# EAGLE design TT7D v1.0 (EAGLE 7.7.0)
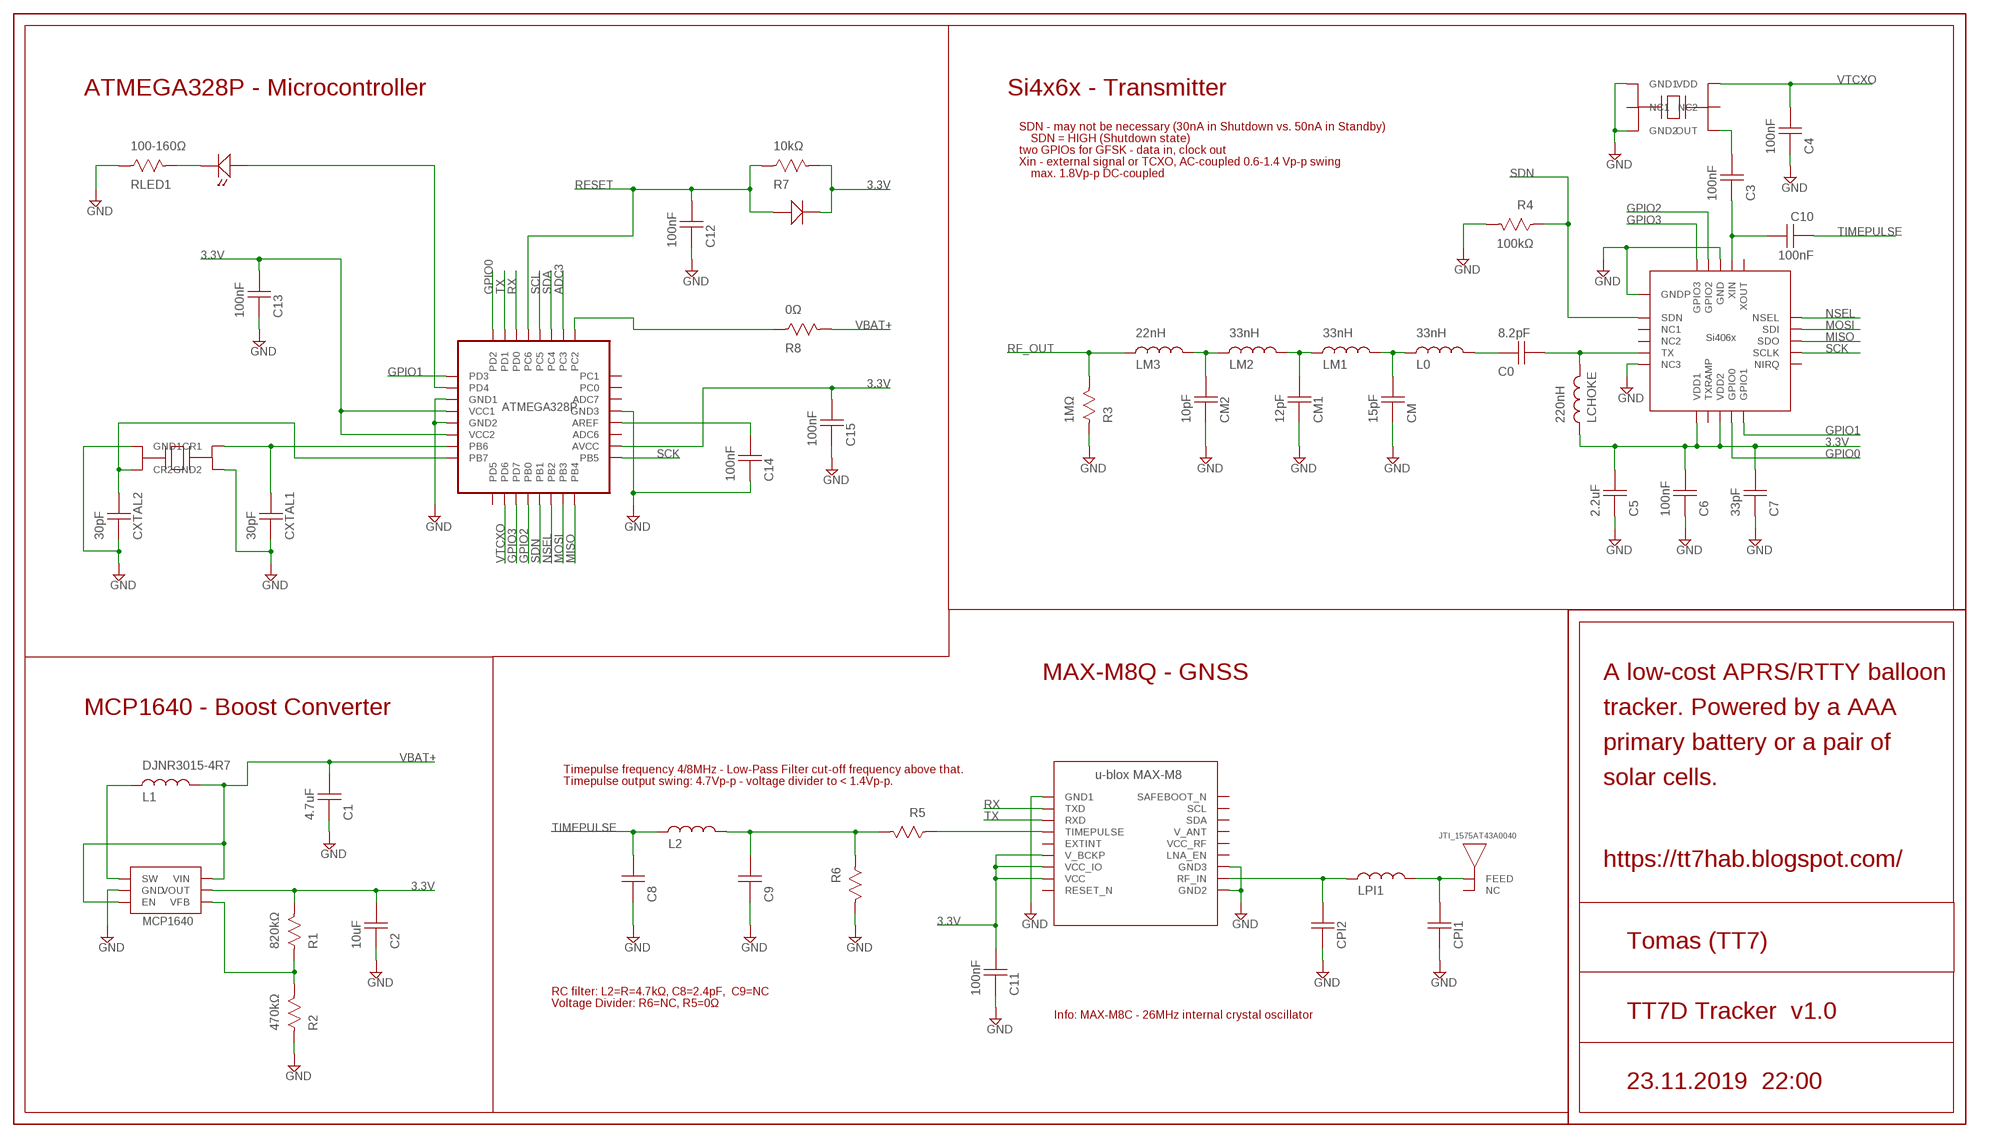
[diagram p0: schematic, sheet 1]

## Parts
ANT1  JTI_1575AT43A0040  [JTI_1575AT43A0040]
C0  8.2pF  CAP0402  [CAP0402]
C1  4.7uF  CAP0402  [CAP0402]
C2  10uF  CAP0402  [CAP0402]
C3  100nF  CAP0402  [CAP0402]
C4  100nF  CAP0402  [CAP0402]
C5  2.2uF  CAP0402  [CAP0402]
C6  100nF  CAP0402  [CAP0402]
C7  33pF  CAP0402  [CAP0402]
C8  CAP0402  [CAP0402]
C9  CAP0402  [CAP0402]
C10  100nF  CAP0402  [CAP0402]
C11  100nF  CAP0402  [CAP0402]
C12  100nF  CAP0402  [CAP0402]
C13  100nF  CAP0402  [CAP0402]
C14  100nF  CAP0402  [CAP0402]
C15  100nF  CAP0402  [CAP0402]
CM  15pF  CAP0402  [CAP0402]
CM1  12pF  CAP0402  [CAP0402]
CM2  10pF  CAP0402  [CAP0402]
CPI1  CAP0402  [CAP0402]
CPI2  CAP0402  [CAP0402]
CXTAL1  30pF  CAP0402  [CAP0402]
CXTAL2  30pF  CAP0402  [CAP0402]
D1  DIODE0402  [DIODE0402]
L0  33nH  IND0402  [IND0402]
L1  DJNR3015-4R7  DJNR3015  [DJNR3015]
L2  IND0402  [IND0402]
LCHOKE  220nH  IND0402  [IND0402]
LED1  LED0603  [LED0603]
LM1  33nH  IND0402  [IND0402]
LM2  33nH  IND0402  [IND0402]
LM3  22nH  IND0402  [IND0402]
LPI1  IND0402  [IND0402]
R1  820kΩ  RES0402  [RES0402]
R2  470kΩ  RES0402  [RES0402]
R3  1MΩ  RES0402  [RES0402]
R4  100kΩ  RES0402  [RES0402]
R5  RES0402  [RES0402]
R6  RES0402  [RES0402]
R7  10kΩ  RES0402  [RES0402]
R8  0Ω  RES0402  [RES0402]
RLED1  100-160Ω  RES0402  [RES0402]
U1  ATMEGA328P-AU  [ATMEGA328P-AU]
U2  UBLOX_MAX-7C  [UBLOX_MAX-7C]
U3  SI406X  [SI406X]
U4  IT3205CE_TCXO_6P  [IT3205CE_TCXO_6P]
U5  MCP1640  [MCP1640]
XTAL1  LFXTAL055663  [LFXTAL055663]

## Nets
3.3V: C2.P$2 C5.P$2 C6.P$2 C7.P$2 C11.P$2 C13.P$2 C15.P$2 D1.CATHODE LCHOKE.P$1 R1.P$2 R7.P$2 U1.AVCC U1.VCC1 U1.VCC2 U2.V_BCKP U2.VCC U2.VCC_IO U3.VDD1 U3.VDD2 U5.VOUT
ADC3: U1.PC3
GND: C1.P$1 C2.P$1 C4.P$1 C5.P$1 C6.P$1 C7.P$1 C8.P$1 C9.P$1 C11.P$1 C12.P$1 C13.P$1 C14.P$1 C15.P$1 CM1.P$1 CM2.P$1 CM.P$1 CPI1.P$1 CPI2.P$1 CXTAL1.P$1 CXTAL2.P$1 R2.P$1 R3.P$1 R4.P$2 R6.P$2 RLED1.P$1 U1.GND1 U1.GND2 U1.GND3 U2.GND1 U2.GND2 U2.GND3 U3.GND U3.GNDP U3.NC3 U4.GND1 U4.GND2 U5.GND XTAL1.GND1 XTAL1.GND2
GPIO0: U1.PD2 U3.GPIO0
GPIO1: U1.PD3 U3.GPIO1
GPIO2: U1.PB0 U3.GPIO2
GPIO3: U1.PD7 U3.GPIO3
MISO: U1.PB4 U3.SDO
MOSI: U1.PB3 U3.SDI
N$1: CXTAL2.P$2 U1.PB7 XTAL1.CRYSTAL2(CR2)
N$3: CXTAL1.P$2 U1.PB6 XTAL1.CRYSTAL1(CR1)
N$4: LED1.CATHODE RLED1.P$2
N$6: CPI2.P$2 LPI1.P$1 U2.RF_IN
N$9: L1.P1 U5.SW
N$10: CM.P$2 L0.P$1 LM1.P$2
N$11: CM1.P$2 LM1.P$1 LM2.P$2
N$12: R1.P$1 R2.P$2 U5.VFB
N$13: CM2.P$2 LM2.P$1 LM3.P$2
N$14: C0.P$1 L0.P$2
N$15: C0.P$2 LCHOKE.P$2 U3.TX
N$16: C14.P$2 U1.AREF
N$17: C3.P$1 C10.P$2 U3.XIN
N$18: C3.P$2 U4.OUT
N$20: LED1.ANODE U1.PD4
N$21: R5.P$1 U2.TIMEPULSE
N$22: C9.P$2 L2.P$2 R5.P$2 R6.P$1
N$23: R8.P$1 U1.PC2
NSEL: U1.PB2 U3.NSEL
RESET: C12.P$2 D1.ANODE R7.P$1 U1.PC6
RF_IN: ANT1.FEED CPI1.P$2 LPI1.P$2
RF_OUT: LM3.P$1 R3.P$2
RX: U1.PD0 U2.TXD
SCK: U1.PB5 U3.SCLK
SCL: U1.PC5
SDA: U1.PC4
SDN: R4.P$1 U1.PB1 U3.SDN
TIMEPULSE: C8.P$2 C10.P$1 L2.P$1
TX: U1.PD1 U2.RXD
VBAT+: C1.P$2 L1.P2 R8.P$2 U5.EN U5.VIN
VTCXO: C4.P$2 U1.PD6 U4.VDD
Unconnected: ANT1.NC U1.ADC6 U1.ADC7 U1.PC0 U1.PC1 U1.PD5 U2.EXTINT U2.LNA_EN U2.RESET_N U2.SAFEBOOT_N U2.SCL U2.SDA U2.V_ANT U2.VCC_RF U3.NC1 U3.NC2 U3.NIRQ U3.TXRAMP U3.XOUT U4.NC1 U4.NC2

## Notes on the sheet
- ATMEGA328P - Microcontroller | Si4x6x - Transmitter
- SDN - may not be necessary (30nA in Shutdown vs. 50nA in Standby)
- SDN = HIGH (Shutdown state)
- two GPIOs for GFSK - data in, clock out
- Xin - external signal or TCXO, AC-coupled 0.6-1.4 Vp-p swing
- max. 1.8Vp-p DC-coupled
- MAX-M8Q - GNSS | A low-cost APRS/RTTY balloon
- MCP1640 - Boost Converter | tracker. Powered by a AAA
- primary battery or a pair of
- Timepulse frequency 4/8MHz - Low-Pass Filter cut-off frequency above that.
- Timepulse output swing: 4.7Vp-p - voltage divider to < 1.4Vp-p. | solar cells.
- https://tt7hab.blogspot.com/
- Tomas (TT7)
- RC filter: L2=R=4.7kΩ, C8=2.4pF,  C9=NC
- Voltage Divider: R6=NC, R5=0Ω
- Info: MAX-M8C - 26MHz internal crystal oscillator | TT7D Tracker  v1.0
- 23.11.2019  22:00

## Library data of the parts
ANT1 = TT7:JTI_1575AT43A0040: JTI_1575AT43A0040 GNSS antenna footprint.
C0 C1-C15 CM CM1 CM2 CPI1 CPI2 CXTAL1 CXTAL2 = TT7:CAP0402: CAPACITOR 0402 - 1 x 0.5 x 0.35mm
D1 = TT7:DIODE0402: DIODE 0402 - 1x0.5x0.35mm. Pad size 0.5x0.6mm. Solder Mask: 0.051mm around pads. Stencil: 66% pad coverage.
L0 L2 LCHOKE LM1-LM3 LPI1 = TT7:IND0402: INDUCTOR 0402 - 1 x 0.5 x 0.35mm
L1 = TT7:DJNR3015: DJNR3015 inductor footprint.
LED1 = TT7:LED0603: LED 0603
R1-R8 RLED1 = TT7:RES0402: RESISTOR 0402 - 1 x 0.5 x 0.35mm
U1 = TT7:ATMEGA328P-AU: ATMEGA328P in a TQFP32 package.; DESCRIPTION: 8-bit Microcontroller with In-System Programmable Flash; MPN: ATMEGA328P-AU; OC_FARNELL: 1715486; OC_NEWARK: 14R4631; PACKAGE: TQFP-32; SUPPLIER: Atmel
U2 = TT7:UBLOX_MAX-7C: U-Blox MAX-M8.
U3 = TT7:SI406X: SI406x transmitter footprint.
U4 = TT7:IT3205CE_TCXO_6P: IT3205CE 16.369MHz TCXO with 6 pads.
U5 = TT7:MCP1640: MCP1640 in SOT23 package.
XTAL1 = TT7:LFXTAL055663: LFXTAL055663 XTAL footprint in a 5.0x3.2mm package.

## Board
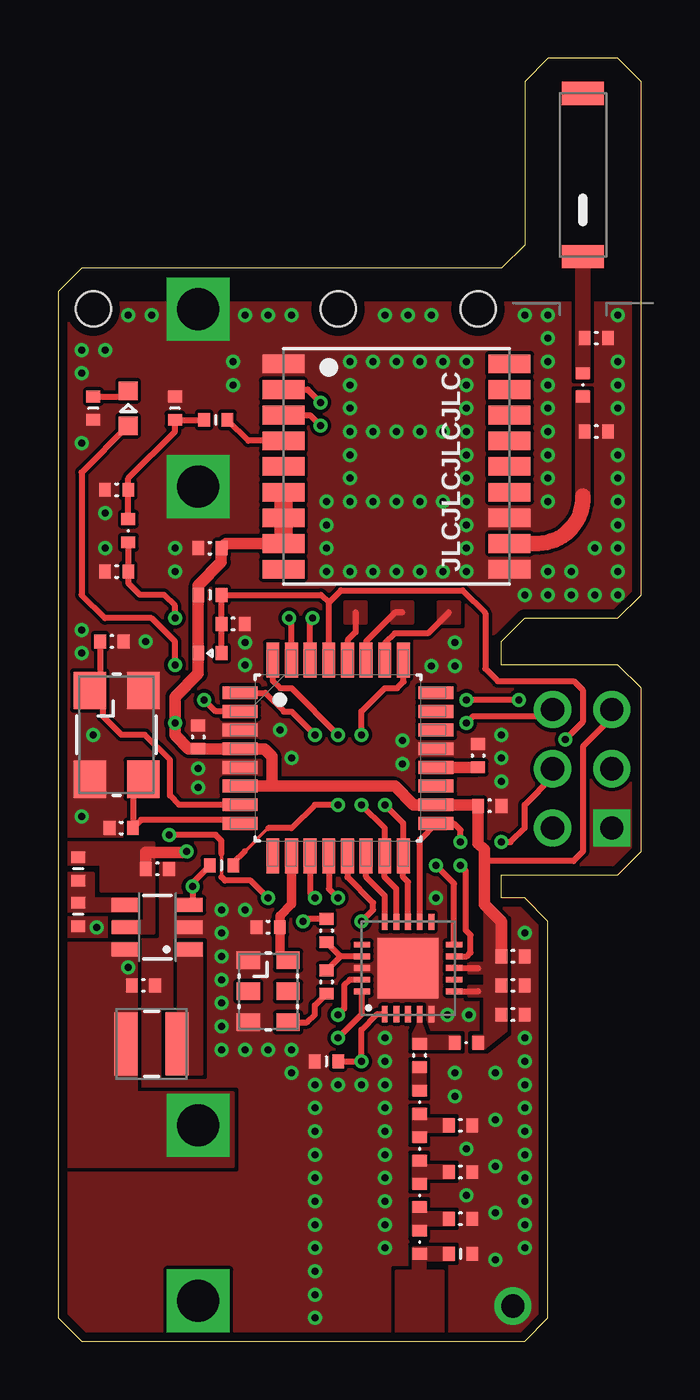
[diagram p1: board, top side]
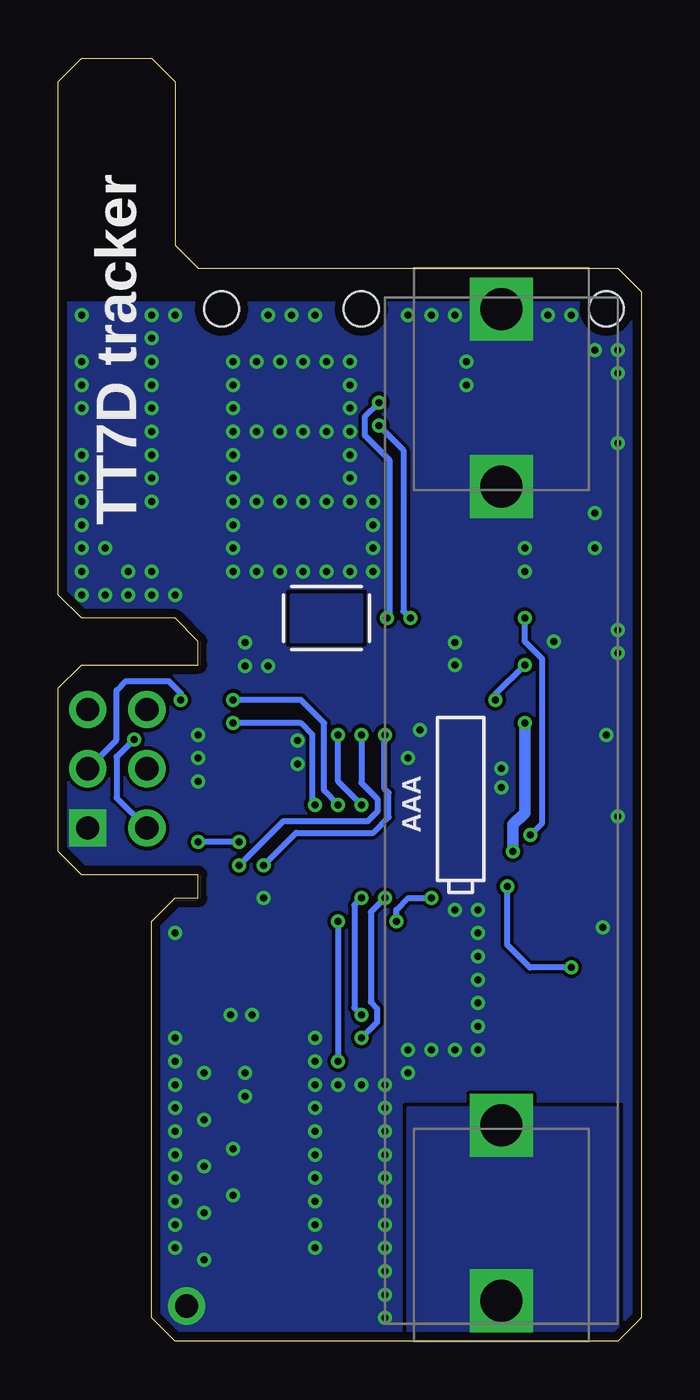
[diagram p2: board, bottom side, seen from below]

Size 25 x 55 mm. Coordinates in mm from the lower left corner, seen from the top.
Outline: 0,1 1,0 20,0 21,1 21,18 20,19 19,19 19,20 24,20 25,21 25,28 24,29 19,29 19,30 20,31 24,31 25,32 25,54 24,55 21,55 20,54 20,47 19,46 1,46 0,45 0,1
Copper layers (1*16): Top 0.035559375mm / dielectric 1.6mm / Bottom 0.035559375mm
Design rules "oshpark-2layer *": minimum track width 6mil, minimum drill 10mil, track to track 6mil, track to pad 6mil, pad to pad 6mil, via to via 6mil, smd to smd 6mil, copper to edge 15mil, drill to drill 6mil, minimum pad ring 5mil, minimum via ring 5mil, stop-mask expansion 2.5mil, vias tented up to drill 20mil, thermal gap 10mil
Holes 1.5 mm at 1.5,44.25 12,44.25 18,44.25

### Footprints (pad centres in the part's own frame; a part is rotated, then mirrored left to right if it is on the bottom)
JTI_1575AT43A0040 = smd 1 x 1.8: FEED -3.5,0; NC 3.5,0
CAP0402 = smd 0.5 x 0.6: P$1 -0.5,0; P$2 0.5,0
DIODE0402 = smd 0.5 x 0.6: ANODE -0.5,0; CATHODE 0.5,0
IND0402 = smd 0.5 x 0.6: P$1 -0.5,0; P$2 0.5,0
DJNR3015 = smd 1 x 2.7: P1 -1.1,0; P2 1.1,0
LED0603 = smd 0.8 x 0.8: ANODE -0.75,0; CATHODE 0.75,0
RES0402 = smd 0.5 x 0.6: P$1 -0.5,0; P$2 0.5,0
ATMEGA328P-AU = smd 1.5 x 0.55: ADC6 4.2,-1.2; ADC7 4.2,1.2; AREF 4.2,-0.4; AVCC 4.2,-2; GND1 -4.2,1.2; GND2 -4.2,-0.4; GND3 4.2,0.4; PB5 4.2,-2.8; PB6 -4.2,-2; PB7 -4.2,-2.8; PC0 4.2,2; PC1 4.2,2.8; PD3 -4.2,2.8; PD4 -4.2,2; VCC1 -4.2,0.4; VCC2 -4.2,-1.2 | smd 0.55 x 1.5: PB0 -0.4,-4.2; PB1 0.4,-4.2; PB2 1.2,-4.2; PB3 2,-4.2; PB4 2.8,-4.2; PC2 2.8,4.2; PC3 2,4.2; PC4 1.2,4.2; PC5 0.4,4.2; PC6 -0.4,4.2; PD0 -1.2,4.2; PD1 -2,4.2; PD2 -2.8,4.2; PD5 -2.8,-4.2; PD6 -2,-4.2; PD7 -1.2,-4.2
UBLOX_MAX-7C = smd 1.8 x 0.8: EXTINT -4.85,0; GND1 -4.85,4.4; GND2 4.85,-4.4; GND3 4.85,-2.2; LNA_EN 4.85,-1.1; RESET_N -4.85,-4.4; RF_IN 4.85,-3.3; RXD -4.85,2.2; SAFEBOOT_N 4.85,4.4; SCL 4.85,3.3; SDA 4.85,2.2; TIMEPULSE -4.85,1.1; TXD -4.85,3.3; V_ANT 4.85,1.1; V_BCKP -4.85,-1.1; VCC -4.85,-3.3; VCC_IO -4.85,-2.2; VCC_RF 4.85,0
SI406X = smd 0.25 x 0.7: GND 0,1.975; GPIO0 0.5,-1.975; GPIO1 1,-1.975; GPIO2 -0.5,1.975; GPIO3 -1,1.975; TXRAMP -0.5,-1.975; VDD1 -1,-1.975; VDD2 0,-1.975; XIN 0.5,1.975; XOUT 1,1.975 | smd 2.6 x 2.6: GNDP 0,0 | smd 0.7 x 0.25: NC1 -1.975,0.5; NC2 -1.975,0; NC3 -1.975,-1; NIRQ 1.975,-1; NSEL 1.975,1; SCLK 1.975,-0.5; SDI 1.975,0.5; SDN -1.975,1; SDO 1.975,0; TX -1.975,-0.5
IT3205CE_TCXO_6P = smd 0.75 x 1: GND1 -1.325,-0.85; GND2 1.325,-0.85; NC1 0,-0.85; NC2 0,0.85; OUT 1.325,0.85; VDD -1.325,0.85
MCP1640 = smd 0.6 x 1.1: EN 0.95,-1.4; GND 0,-1.4; SW -0.95,-1.4; VFB 0.95,1.4; VIN -0.95,1.4; VOUT 0,1.4
LFXTAL055663 = smd 1.6 x 1.4: CRYSTAL1 -1.9,-1.15; CRYSTAL2 1.9,1.15; GND1 1.9,-1.15; GND2 -1.9,1.15

### Placement (x,y rotation side)
ANT1  22.5,50 90 top
C0  15.5,12.25 90 top
C1  3.65,15.25 180 top
C2  4.25,20.25 180 top
C3  11.5,15.4 270 top
C4  9,17.75 0 top
C5  19.5,16.5 180 top
C6  19.5,15.25 180 top
C7  19.5,14 180 top
C8  2.5,33 0 top
C9  2.5,36.5 0 top
C10  11.5,17.6 270 top
C11  6.5,34 0 top
C12  7.5,30.75 180 top
C13  6,25.9 270 top
C14  18,25.1 270 top
C15  18.5,22.95 180 top
CM  17.25,9.25 180 top
CM1  17.25,7.25 180 top
CM2  17.25,5.25 180 top
CPI1  23.07,43 180 top
CPI2  23.07,39 180 top
CXTAL1  2.3,30 180 top
CXTAL2  2.7,22 0 top
D1  6.5,29.5 180 top
L0  15.5,10.25 90 top
L1  4,12.75 180 top
L2  3,34.75 90 top
LCHOKE  17.5,12.8 180 top
LED1  3,40 90 top
LM1  15.5,8.25 90 top
LM2  15.5,6.25 90 top
LM3  15.5,4.25 90 top
LPI1  22.5,41 90 top
R1  0.85,20.25 90 top
R2  0.85,18.3 90 top
R3  17.25,3.75 180 top
R4  11.5,12 180 top
R5  6.75,39.5 180 top
R6  5,40 90 top
R7  6.5,32 180 top
R8  7,20.4 180 top
RLED1  1.5,40 90 top
U1  12,25 0 top
U2  14.5,37.5 0 top
U3  15,16 90 top
U4  9,15 270 top
U5  4.25,17.75 90 top
XTAL1  2.5,26 270 top

### Tracks (layer width: path | path; a pad name or v marks a point on that pad's centre or on a via)
3.3V  (via drill 0.3 pad 0.6, 1 pad 1.6)
  Top 0.25: U3.VDD1 18,15 | U3.VDD2 18,16 | v23.74,27.08 23.74,26.74 22.5,25.5 22.5,21 22.09,20.59 18.37,20.59 18.27,20.69
  Top 0.4: 17.95,23 C15.P$2
  Top 0.5: C5.P$2 19,17.99 18.27,18.72 18.27,20.69 18.27,21.08 18,21.35 C15.P$2 | 9.16,23.8 14.43,23.8 15.23,23 U1.AVCC 17.95,23 | 9.16,23.8 U1.VCC2 | 9.16,23.8 9.16,25.07 8.84,25.4 U1.VCC1 C13.P$2 5.6,25.4 5,26 v5,26.5 5,27.62 6,28.62 D1.CATHODE R7.P$2 6,32.4 6.99,33.39 C11.P$2 7.2,34.2 U2.VCC | v5.5,21 5.46,20.96 3.74,20.96 3.75,20.96 C2.P$2
  Top 0.8: U2.VCC U2.VCC_IO U2.V_BCKP
  Bottom 0.5: v5.5,21 5.5,22.15 5,22.65 v5,26.5
  pour Top (no thermals): 18.3,13.06 18.3,18 19.2,18 19.2,13.3 18.25,12.55 17.8,12.55 17.8,13.06
  pour Top (no thermals): 18.5,14.8 18.5,15.2 17.6,15.2 17.6,14.8
  pour Top (no thermals): 17.6,16.2 18.4,16.2 18.4,15.8 17.6,15.8
  pour Top (no thermals): 18.3,15.5 18.3,18.5 18.7,18.5 18.7,17.3 19,17 19,15.5
  pour Top (no thermals): 0,21.35 4.1,21.35 4.1,17.5 2.35,17.5 2.35,18 3.7,18 3.7,19.3 1.85,19.3 1.85,20.45 0,20.45
ADC3
  Top 0.25: 16.75,31.25 15.85,30.35 14.42,30.35 14.01,29.94 14.01,29.21 U1.PC3
  pour Top: 16.3,30.8 16.3,31.7 17.2,31.7 17.2,30.8
GND  (via drill 0.3 pad 0.6, 1 pad 1.6, 1.8)
  other vias: 23.74,22 19.5,1.5 21,37 21,38 17.5,42 7.5,42 24,38 24,37 24,36 24,35 24,34 20,11 14,11 14,10 14,9 14,8 14,7 14,6 14,5 14,4 20,4 20,5 20,6 20,7 20,8 20,9 20,10 8,29.95 20,12 20,13 10,12.5 9,12.5 8,12.5 7,12.5 7,13.5 7,14.5 7,15.5 10,11.5 11,11 12,11 13,11 11,4 11,5 11,6 11,7 11,8 11,9 11,10 11,3 11,2 11,1 17,10.5 17,11.5 17.5,8.25 17.5,6.25 20,17.5 16.7,14 17.6,14 18.75,5.5 18.75,7.5 18.75,9.5 18.75,3.5 21,39 21,40 21,41 21,42 21,43 21,44 24,44 24,42 24,41 24,40 21,36 24,33 23,32 24,32 22,32 21,32 20,32 22,33 23,34 21,33 6,36.65 6,44.25 7,16.5 7,17.5 7,18.5 14,12 14,13 8,18.5 18.75,11.5 1.65,17.75 6,24.55 6,23.75 19,24 1,38.5 1,41.5 1,22.5 2,35.5 2,34 20,44 16,44 15,44 14,44 10,44 9,44 8,44 4,44 3,44 1,42.5 3.75,30 1.5,26 9.5,26.2 19,25 8,29 12.5,42 13.5,42 14.5,42 15.5,42 16.5,42 17.5,33 16.5,33 15.5,33 13.5,33 14.5,33 12.5,33 11.5,33 17.5,34 17.5,35 17.5,36 17.5,37 17.5,38 17.5,39 17.5,40 17.5,41 16.5,36 15.5,36 14.5,36 13.5,36 12.5,36 11.5,36 16.5,39 15.5,39 14.5,39 13.5,39 12.5,39 11.5,35 11.5,34 12.5,40 12.5,41 12.5,37 12.5,38 7.5,41 2,42.5 5,34 5,33 1,29.5 1,30.5 14.75,24.75 16.2,19 10,25 14.75,25.75 17,29.95 17,28.95 16,28.95 19,26
  pour Top (rank 2, no thermals): 0,0 0,44.5 25,44.5 25,32 24,31 20,31 20,29 24,29 25,28 25,21 24,20 19,20 19,19 20,19 21,18 21,0
  pour Bottom (rank 2, no thermals): 0,0 0,44.5 25,44.5 25,32 24,31 20,31 20,29 24,29 25,28 25,21 24,20 19,20 19,19 20,19 21,18 21,0
GPIO0  (via drill 0.3 pad 0.6)
  Top 0.25: U3.GPIO0 17.52,16.5 17.69,16.67 17.69,17.41 17.48,17.62 17.48,20.18 v17.25,20.4 | U1.PD2 9.2,28.31 9.52,28 10.01,28 v12,26
  Bottom 0.25: v17.25,20.4 15.35,22.3 11.72,22.3 11.31,22.71 11.31,23.26 12,23.94 v12,26
GPIO1  (via drill 0.3 pad 0.6)
  Top 0.25: U3.GPIO1 16.98,19.62 v16.2,20.4 | U1.PD3 8.87,27.8 9.68,26.99 10.01,26.99 v11,26
  Bottom 0.25: v16.2,20.4 14.8,21.8 11.5,21.8 10.84,22.46 10.84,23.51 11.01,23.68 v11.01,25.99 v11,26
GPIO2  (via drill 0.3 pad 0.6)
  Top 0.25: U3.GPIO2 12.5,15.5 12.26,15.27 12.26,14.26 v12,14 | U1.PB0 11.6,19.4 v12,19
  Bottom 0.25: v12,19 12.3,18.7 12.3,14.3 v12,14
GPIO3  (via drill 0.3 pad 0.6)
  Top 0.25: v12,13 13.03,14.03 U3.GPIO3 | U1.PD7 10.8,19.2 v11,19
  Bottom 0.25: v11,19 11.6,18.4 11.6,14.54 11.31,14.25 11.31,13.69 v12,13
MISO  (via drill 0.3 pad 0.6, 1 pad 1.6)
  Top 0.25: U3.SDO 15,19.68 14.79,19.9 14.79,20.79 U1.PB4 14.8,22.2 v14,23 | v17.5,26.5 17.8,26.8 20.92,26.8 v21.2,27.08
  Bottom 0.25: v14,23 14.1,23.1 14.1,26 14.6,26.5 v17.5,26.5
MOSI  (via drill 0.3 pad 0.6, 1 pad 1.6)
  Top 0.25: U3.SDI 14.5,19.4 14,19.9 U1.PB3 14,22 v13,23 | v19.75,27.5 v17.5,27.5
  Bottom 0.25: v23.74,24.54 22.5,25.78 22.5,27.9 22.1,28.3 20.26,28.3 19.75,27.79 v19.75,27.5 | v13,23 13.6,23.6 13.6,26.5 14.6,27.5 v17.5,27.5
N$1
  Top 0.25: 3.4,22.2 CXTAL2.P$2 | XTAL1.CRYSTAL2 3.2,23.65 CXTAL2.P$2 | U1.PB7 7.65,22.35 3.55,22.35 CXTAL2.P$2
N$2
  pour Bottom: 12,32 15,32 15,30 12,30
N$3
  Top 0.25: CXTAL1.P$2 1.8,27.9 XTAL1.CRYSTAL1 1.92,27.33 1.92,26.79 2.71,26 3.72,26 4.79,24.93 4.79,23.39 5.18,23 U1.PB6
N$4
  Top 0.25: RLED1.P$2 2.75,40.5 LED1.CATHODE
N$6
  Top 0.66: 22.5,36.23 arc-90 20.59,34.2 U2.RF_IN
  pour Top (no thermals): 22.25,40.7 22.75,40.7 22.75,36 22.25,36
  pour Top (no thermals): 20.5,33.95 18.6,33.95 18.6,34.46 20.5,34.46
N$9
  pour Top (no thermals): 5.15,17.05 6.15,17.05 6.15,11.45 4.65,11.45 4.65,14.05 5.15,14.05
N$10
  pour Top (no thermals): 15.22,9.95 15.74,9.95 15.74,8.55 15.22,8.55
  pour Top (no thermals): 15.74,9.51 16.95,9.51 16.95,9 15.74,9
N$11
  pour Top (no thermals): 15.22,7.95 15.74,7.95 15.74,6.55 15.22,6.55
  pour Top (no thermals): 15.74,7 15.74,7.51 16.95,7.51 16.95,7
N$12
  pour Top (no thermals): 3.35,18.45 3.35,18.95 1.5,18.95 1.5,20.05 0,20.05 0,18.45
N$13
  pour Top (no thermals): 15.22,5.95 15.74,5.95 15.74,4.55 15.22,4.55
  pour Top (no thermals): 15.74,5.51 16.95,5.51 16.95,5 15.74,5
N$14
  pour Top (no thermals): 15.22,11.95 15.74,11.95 15.74,10.55 15.22,10.55
N$15
  pour Top (no thermals): 15.22,12.55 15.74,12.55 15.74,13.15 15.56,13.6 15.44,13.6 15.22,13.15
  pour Top (no thermals): 15.44,14.3 15.56,14.3 15.56,13.6 15.44,13.6
  pour Top (no thermals): 15.7,12.55 15.7,13.06 17.2,13.06 17.2,12.55
N$16
  Top 0.5: U1.AREF C14.P$2
N$17
  Top 0.25: U3.XIN 12.1,16.5 | 12.1,16.5 C3.P$1 | C10.P$2 12.1,16.5
N$18
  Top 0.25: U4.OUT 10.68,13.68 11,14 11,14.4 C3.P$2
N$20  (via drill 0.3 pad 0.6)
  Top 0.25: LED1.ANODE 1,37.25 1,32 2,31 4,31 5,30 v5,29 | U1.PD4 6.75,27 v6.25,27.5
  Bottom 0.25: v6.25,27.5 6.25,27.75 v5,29
N$21
  Top 0.25: U2.TIMEPULSE 8.15,38.6 R5.P$1
N$22
  Top 0.25: L2.P$2 C9.P$2 3,37 5,39 R6.P$1 R5.P$2
N$23  (via drill 0.3 pad 0.6)
  Top 0.152: 8,21 9,22
  Top 0.25: v12,23 11,23 10,22 9,22 | R8.P$1 7.5,20.5 8,21 | v13,26 13,27 14,28 14.53,28 14.8,28.28 U1.PC2
  Bottom 0.25: v12,23 13,24 v13,26
NSEL
  Top 0.25: U1.PB2 13.2,19.9 14,19.1 U3.NSEL
RESET  (via drill 0.3 pad 0.6, 1 pad 1.6)
  Top 0.25: D1.ANODE C12.P$2 R7.P$1 11.26,32 11.6,31.66 | U1.PC6 11.6,31.66 | 11.6,31.66 12.12,32.18 17.34,32.18 18.31,31.21 18.31,28.83 18.84,28.3 22.11,28.3 22.49,27.92 22.49,26.54 v21.75,25.8
  Bottom 0.25: v21.75,25.8 22.5,25.05 22.5,23.3 v21.2,22
RF_IN
  pour Top (no thermals): 22.25,46.9 22.75,46.9 22.75,41.3 22.25,41.3
RF_OUT
  pour Top (no thermals): 15.22,4 15.74,4 15.74,3 16.5,3 16.5,0 14.5,0 14.5,3 15.22,3
  pour Top (no thermals): 15.74,4 16.95,4 16.95,3.49 15.74,3.49
RX  (via drill 0.3 pad 0.6)
  Top 0.25: U1.PD0 10.8,30.9 v10.9,31 | U2.TXD 10.7,40.8 v11.25,40.25
  Bottom 0.25: v11.25,40.25 11.86,39.64 11.86,38.84 10.8,37.78 10.8,31.1 v10.9,31
SCK  (via drill 0.3 pad 0.6, 1 pad 1.6)
  Top 0.25: U3.SCLK 15.5,21.5 U1.PB5 16.97,22.19 17.25,21.91 v17.25,21.4 | v19,21.4 19.4,21.4 20,22 20,23 21.2,24.2 v21.2,24.54
  Bottom 0.25: v17.25,21.4 v19,21.4
SCL
  Top 0.25: 12.75,31.25 12.75,30.4 12.41,30.05 U1.PC5
  pour Top: 12.3,30.8 12.3,31.7 13.2,31.7 13.2,30.8
SDA
  Top 0.25: 14.75,31.25 14.45,31.25 13.2,30 U1.PC4
  pour Top: 14.3,30.8 14.3,31.7 15.2,31.7 15.2,30.8
SDN  (via drill 0.3 pad 0.6)
  Top 0.25: R4.P$1 v13,12 13,13.35 13.68,14.03 U3.SDN | v13,18 13.5,18.5 13.5,18.8 12.4,19.9 U1.PB1
  Bottom 0.25: v13,18 v13,12
TIMEPULSE  (via drill 0.3 pad 0.6)
  Top 0.152: 7,19.9 7,20.9
  Top 0.25: C10.P$1 10.6,18.1 v10.5,18 | v9,19 8.25,19.75 7.15,19.75 7,19.9 | L2.P$1 C8.P$2 3,32.5 3.5,32 4.54,32 5,31.54 v5,31 | 7,20.9 7,21.45 6.75,21.7 v4.75,21.7
  Bottom 0.25: v10.5,18 10.5,18.5 10,19 v9,19 | v4.75,21.7 4.25,22.2 4.25,29.25 5,30 v5,31
TX  (via drill 0.3 pad 0.6)
  Top 0.25: U1.PD1 10,30.9 v9.9,31 | U2.RXD 10.8,39.7 v11.25,39.25
  Bottom 0.25: v11.25,39.25 10.2,38.2 10.2,31.3 v9.9,31
VBAT+  (via drill 0.3 pad 0.6, 1.8, 1.8 pad 2.7)
  Top 0.25: R8.P$2 5.75,19.65 v5.75,19.5 5.75,18.8 U5.EN
  Bottom 0.25: v3,16.02 4.78,16.02 5.75,17 v5.75,19.5
  other vias: 6,1.73 6,9.25
  pour Bottom (no thermals): 1,0 1,10 10,10 10,0
  pour Top (no thermals): 0,17.05 3.35,17.05 3.35,10.65 7.5,10.65 7.5,7.5 0,7.5
VTCXO
  Top 0.4: U4.VDD 9.5,16.68 C4.P$2 9.5,18.23 10,18.74 U1.PD6

### Text on the board
tPlace: JLCJLCJLCJLC
bPlace: TT7D tracker | AAA
tDocu: ICSP header | MISO | VCC | SCK | MOSI | /RESET | GND | Coplanar Waveguides for 0.6mm thick PCB | Energizer Ultimate Lithium AAA: 45mm length